# Altium schematic sheet HEADER_COLLECTION.SchDoc
size B
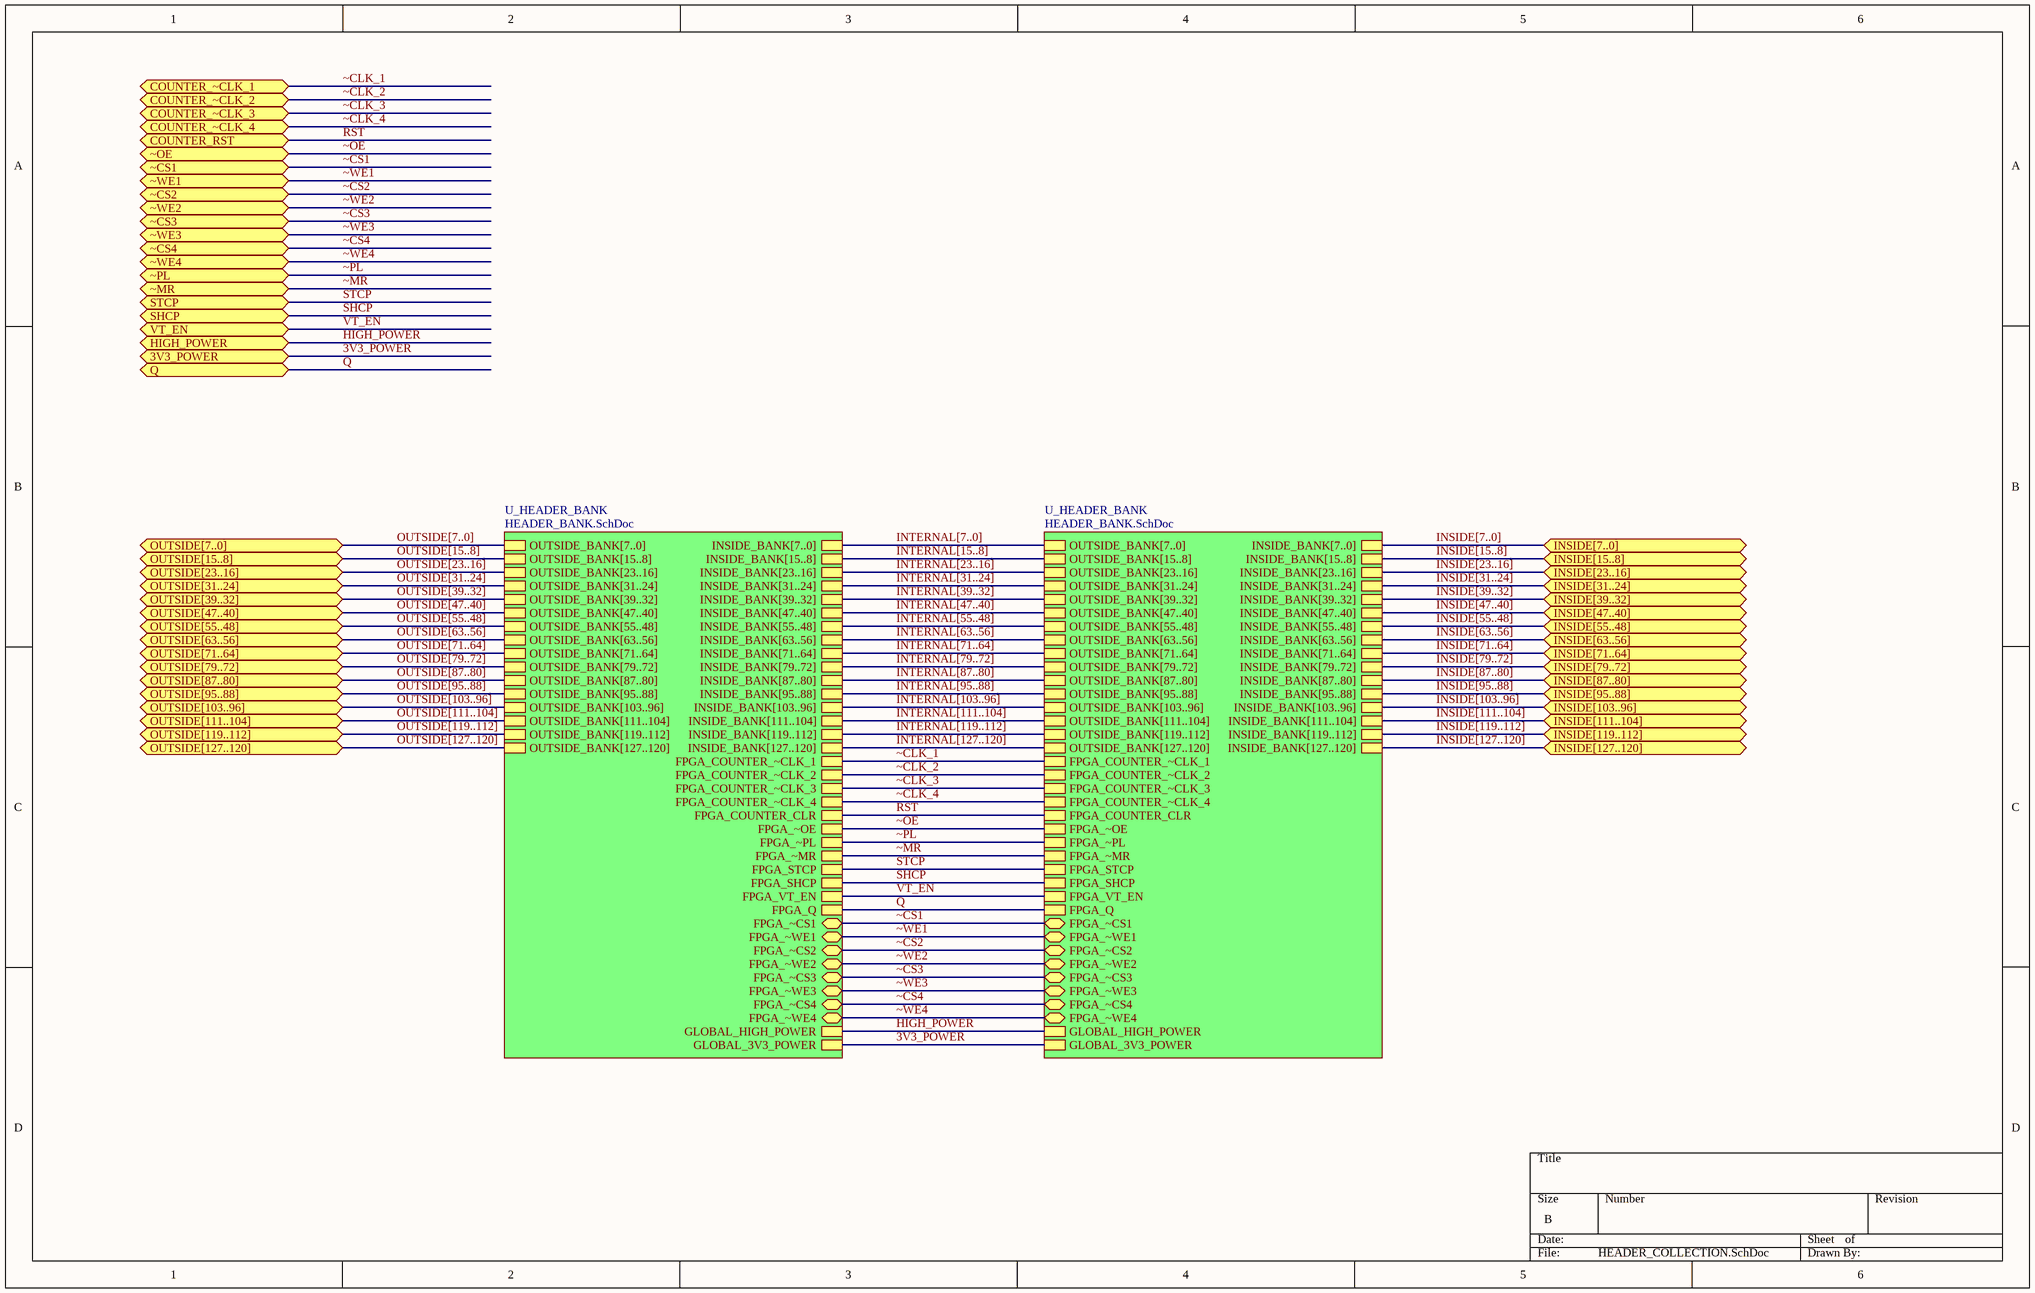
[diagram p0: HEADER_COLLECTION.SchDoc]

## Sub-sheets
U_HEADER_BANK = HEADER_BANK.SchDoc: OUTSIDE_BANK[7..0], OUTSIDE_BANK[15..8], OUTSIDE_BANK[23..16], OUTSIDE_BANK[31..24], OUTSIDE_BANK[39..32], OUTSIDE_BANK[47..40], OUTSIDE_BANK[55..48], OUTSIDE_BANK[63..56], OUTSIDE_BANK[71..64], OUTSIDE_BANK[79..72], OUTSIDE_BANK[87..80], OUTSIDE_BANK[95..88], OUTSIDE_BANK[103..96], OUTSIDE_BANK[111..104], OUTSIDE_BANK[119..112], OUTSIDE_BANK[127..120], INSIDE_BANK[7..0], INSIDE_BANK[15..8], INSIDE_BANK[23..16], INSIDE_BANK[31..24], INSIDE_BANK[39..32], INSIDE_BANK[47..40], INSIDE_BANK[55..48], INSIDE_BANK[63..56], INSIDE_BANK[71..64], INSIDE_BANK[79..72], INSIDE_BANK[87..80], INSIDE_BANK[95..88], INSIDE_BANK[103..96], INSIDE_BANK[111..104], INSIDE_BANK[119..112], INSIDE_BANK[127..120], FPGA_COUNTER_~CLK_1, FPGA_COUNTER_~CLK_2, FPGA_COUNTER_~CLK_3, FPGA_COUNTER_~CLK_4, FPGA_COUNTER_CLR, FPGA_~OE, FPGA_~PL, FPGA_~MR, FPGA_STCP, FPGA_SHCP, FPGA_VT_EN, GLOBAL_HIGH_POWER, GLOBAL_3V3_POWER, FPGA_Q, FPGA_~CS1, FPGA_~WE1, FPGA_~CS2, FPGA_~CS3, FPGA_~WE3, FPGA_~CS4, FPGA_~WE4, FPGA_~WE2
U_HEADER_BANK = HEADER_BANK.SchDoc: OUTSIDE_BANK[7..0], OUTSIDE_BANK[15..8], OUTSIDE_BANK[23..16], OUTSIDE_BANK[31..24], OUTSIDE_BANK[39..32], OUTSIDE_BANK[47..40], OUTSIDE_BANK[55..48], OUTSIDE_BANK[63..56], OUTSIDE_BANK[71..64], OUTSIDE_BANK[79..72], OUTSIDE_BANK[87..80], OUTSIDE_BANK[95..88], OUTSIDE_BANK[103..96], OUTSIDE_BANK[111..104], OUTSIDE_BANK[119..112], OUTSIDE_BANK[127..120], INSIDE_BANK[7..0], INSIDE_BANK[15..8], INSIDE_BANK[23..16], INSIDE_BANK[31..24], INSIDE_BANK[39..32], INSIDE_BANK[47..40], INSIDE_BANK[55..48], INSIDE_BANK[63..56], INSIDE_BANK[71..64], INSIDE_BANK[79..72], INSIDE_BANK[87..80], INSIDE_BANK[95..88], INSIDE_BANK[103..96], INSIDE_BANK[111..104], INSIDE_BANK[119..112], INSIDE_BANK[127..120], FPGA_COUNTER_~CLK_1, FPGA_COUNTER_~CLK_2, FPGA_COUNTER_~CLK_3, FPGA_COUNTER_~CLK_4, FPGA_COUNTER_CLR, FPGA_~OE, FPGA_~PL, FPGA_~MR, FPGA_STCP, FPGA_SHCP, GLOBAL_HIGH_POWER, GLOBAL_3V3_POWER, FPGA_Q, FPGA_VT_EN, FPGA_~CS1, FPGA_~WE1, FPGA_~CS2, FPGA_~CS3, FPGA_~WE3, FPGA_~CS4, FPGA_~WE4, FPGA_~WE2

## Ports
3V3_POWER, COUNTER_RST, COUNTER_~CLK_1, COUNTER_~CLK_2, COUNTER_~CLK_3, COUNTER_~CLK_4, HIGH_POWER, INSIDE[7..0], INSIDE[15..8], INSIDE[23..16], INSIDE[31..24], INSIDE[39..32], INSIDE[47..40], INSIDE[55..48], INSIDE[63..56], INSIDE[71..64], INSIDE[79..72], INSIDE[87..80], INSIDE[95..88], INSIDE[103..96], INSIDE[111..104], INSIDE[119..112], INSIDE[127..120], OUTSIDE[7..0], OUTSIDE[15..8], OUTSIDE[23..16], OUTSIDE[31..24], OUTSIDE[39..32], OUTSIDE[47..40], OUTSIDE[55..48], OUTSIDE[63..56], OUTSIDE[71..64], OUTSIDE[79..72], OUTSIDE[87..80], OUTSIDE[95..88], OUTSIDE[103..96], OUTSIDE[111..104], OUTSIDE[119..112], OUTSIDE[127..120], Q, SHCP, STCP, VT_EN, ~CS1, ~CS2, ~CS3, ~CS4, ~MR, ~OE, ~PL, ~WE1, ~WE2, ~WE3, ~WE4

## Nets
3V3_POWER: port 3V3_POWER, sheet U_HEADER_BANK/GLOBAL_3V3_POWER, sheet U_HEADER_BANK/GLOBAL_3V3_POWER
HIGH_POWER: port HIGH_POWER, sheet U_HEADER_BANK/GLOBAL_HIGH_POWER, sheet U_HEADER_BANK/GLOBAL_HIGH_POWER
Q: port Q, sheet U_HEADER_BANK/FPGA_Q, sheet U_HEADER_BANK/FPGA_Q
RST: port COUNTER_RST, sheet U_HEADER_BANK/FPGA_COUNTER_CLR, sheet U_HEADER_BANK/FPGA_COUNTER_CLR
SHCP: port SHCP, sheet U_HEADER_BANK/FPGA_SHCP, sheet U_HEADER_BANK/FPGA_SHCP
STCP: port STCP, sheet U_HEADER_BANK/FPGA_STCP, sheet U_HEADER_BANK/FPGA_STCP
VT_EN: port VT_EN, sheet U_HEADER_BANK/FPGA_VT_EN, sheet U_HEADER_BANK/FPGA_VT_EN
~CLK_1: port COUNTER_~CLK_1, sheet U_HEADER_BANK/FPGA_COUNTER_~CLK_1, sheet U_HEADER_BANK/FPGA_COUNTER_~CLK_1
~CLK_2: port COUNTER_~CLK_2, sheet U_HEADER_BANK/FPGA_COUNTER_~CLK_2, sheet U_HEADER_BANK/FPGA_COUNTER_~CLK_2
~CLK_3: port COUNTER_~CLK_3, sheet U_HEADER_BANK/FPGA_COUNTER_~CLK_3, sheet U_HEADER_BANK/FPGA_COUNTER_~CLK_3
~CLK_4: port COUNTER_~CLK_4, sheet U_HEADER_BANK/FPGA_COUNTER_~CLK_4, sheet U_HEADER_BANK/FPGA_COUNTER_~CLK_4
~CS1: port ~CS1, sheet U_HEADER_BANK/FPGA_~CS1, sheet U_HEADER_BANK/FPGA_~CS1
~CS2: port ~CS2, sheet U_HEADER_BANK/FPGA_~CS2, sheet U_HEADER_BANK/FPGA_~CS2
~CS3: port ~CS3, sheet U_HEADER_BANK/FPGA_~CS3, sheet U_HEADER_BANK/FPGA_~CS3
~CS4: port ~CS4, sheet U_HEADER_BANK/FPGA_~CS4, sheet U_HEADER_BANK/FPGA_~CS4
~MR: port ~MR, sheet U_HEADER_BANK/FPGA_~MR, sheet U_HEADER_BANK/FPGA_~MR
~OE: port ~OE, sheet U_HEADER_BANK/FPGA_~OE, sheet U_HEADER_BANK/FPGA_~OE
~PL: port ~PL, sheet U_HEADER_BANK/FPGA_~PL, sheet U_HEADER_BANK/FPGA_~PL
~WE1: port ~WE1, sheet U_HEADER_BANK/FPGA_~WE1, sheet U_HEADER_BANK/FPGA_~WE1
~WE2: port ~WE2, sheet U_HEADER_BANK/FPGA_~WE2, sheet U_HEADER_BANK/FPGA_~WE2
~WE3: port ~WE3, sheet U_HEADER_BANK/FPGA_~WE3, sheet U_HEADER_BANK/FPGA_~WE3
~WE4: port ~WE4, sheet U_HEADER_BANK/FPGA_~WE4, sheet U_HEADER_BANK/FPGA_~WE4

## Buses and harness runs
bus INSIDE[7..0] = port INSIDE[7..0] = sheet U_HEADER_BANK/INSIDE_BANK[7..0]
bus INSIDE[15..8] = port INSIDE[15..8] = sheet U_HEADER_BANK/INSIDE_BANK[15..8]
bus INSIDE[23..16] = port INSIDE[23..16] = sheet U_HEADER_BANK/INSIDE_BANK[23..16]
bus INSIDE[31..24] = port INSIDE[31..24] = sheet U_HEADER_BANK/INSIDE_BANK[31..24]
bus INSIDE[39..32] = port INSIDE[39..32] = sheet U_HEADER_BANK/INSIDE_BANK[39..32]
bus INSIDE[47..40] = port INSIDE[47..40] = sheet U_HEADER_BANK/INSIDE_BANK[47..40]
bus INSIDE[55..48] = port INSIDE[55..48] = sheet U_HEADER_BANK/INSIDE_BANK[55..48]
bus INSIDE[63..56] = port INSIDE[63..56] = sheet U_HEADER_BANK/INSIDE_BANK[63..56]
bus INSIDE[71..64] = port INSIDE[71..64] = sheet U_HEADER_BANK/INSIDE_BANK[71..64]
bus INSIDE[79..72] = port INSIDE[79..72] = sheet U_HEADER_BANK/INSIDE_BANK[79..72]
bus INSIDE[87..80] = port INSIDE[87..80] = sheet U_HEADER_BANK/INSIDE_BANK[87..80]
bus INSIDE[95..88] = port INSIDE[95..88] = sheet U_HEADER_BANK/INSIDE_BANK[95..88]
bus INSIDE[103..96] = port INSIDE[103..96] = sheet U_HEADER_BANK/INSIDE_BANK[103..96]
bus INSIDE[111..104] = port INSIDE[111..104] = sheet U_HEADER_BANK/INSIDE_BANK[111..104]
bus INSIDE[119..112] = port INSIDE[119..112] = sheet U_HEADER_BANK/INSIDE_BANK[119..112]
bus INSIDE[127..120] = port INSIDE[127..120] = sheet U_HEADER_BANK/INSIDE_BANK[127..120]
bus INTERNAL[7..0] = sheet U_HEADER_BANK/INSIDE_BANK[7..0] = sheet U_HEADER_BANK/OUTSIDE_BANK[7..0]
bus INTERNAL[15..8] = sheet U_HEADER_BANK/INSIDE_BANK[15..8] = sheet U_HEADER_BANK/OUTSIDE_BANK[15..8]
bus INTERNAL[23..16] = sheet U_HEADER_BANK/INSIDE_BANK[23..16] = sheet U_HEADER_BANK/OUTSIDE_BANK[23..16]
bus INTERNAL[31..24] = sheet U_HEADER_BANK/INSIDE_BANK[31..24] = sheet U_HEADER_BANK/OUTSIDE_BANK[31..24]
bus INTERNAL[39..32] = sheet U_HEADER_BANK/INSIDE_BANK[39..32] = sheet U_HEADER_BANK/OUTSIDE_BANK[39..32]
bus INTERNAL[47..40] = sheet U_HEADER_BANK/INSIDE_BANK[47..40] = sheet U_HEADER_BANK/OUTSIDE_BANK[47..40]
bus INTERNAL[55..48] = sheet U_HEADER_BANK/INSIDE_BANK[55..48] = sheet U_HEADER_BANK/OUTSIDE_BANK[55..48]
bus INTERNAL[63..56] = sheet U_HEADER_BANK/INSIDE_BANK[63..56] = sheet U_HEADER_BANK/OUTSIDE_BANK[63..56]
bus INTERNAL[71..64] = sheet U_HEADER_BANK/INSIDE_BANK[71..64] = sheet U_HEADER_BANK/OUTSIDE_BANK[71..64]
bus INTERNAL[79..72] = sheet U_HEADER_BANK/INSIDE_BANK[79..72] = sheet U_HEADER_BANK/OUTSIDE_BANK[79..72]
bus INTERNAL[87..80] = sheet U_HEADER_BANK/INSIDE_BANK[87..80] = sheet U_HEADER_BANK/OUTSIDE_BANK[87..80]
bus INTERNAL[95..88] = sheet U_HEADER_BANK/INSIDE_BANK[95..88] = sheet U_HEADER_BANK/OUTSIDE_BANK[95..88]
bus INTERNAL[103..96] = sheet U_HEADER_BANK/INSIDE_BANK[103..96] = sheet U_HEADER_BANK/OUTSIDE_BANK[103..96]
bus INTERNAL[111..104] = sheet U_HEADER_BANK/INSIDE_BANK[111..104] = sheet U_HEADER_BANK/OUTSIDE_BANK[111..104]
bus INTERNAL[119..112] = sheet U_HEADER_BANK/INSIDE_BANK[119..112] = sheet U_HEADER_BANK/OUTSIDE_BANK[119..112]
bus INTERNAL[127..120] = sheet U_HEADER_BANK/INSIDE_BANK[127..120] = sheet U_HEADER_BANK/OUTSIDE_BANK[127..120]
bus OUTSIDE[7..0] = port OUTSIDE[7..0] = sheet U_HEADER_BANK/OUTSIDE_BANK[7..0]
bus OUTSIDE[15..8] = port OUTSIDE[15..8] = sheet U_HEADER_BANK/OUTSIDE_BANK[15..8]
bus OUTSIDE[23..16] = port OUTSIDE[23..16] = sheet U_HEADER_BANK/OUTSIDE_BANK[23..16]
bus OUTSIDE[31..24] = port OUTSIDE[31..24] = sheet U_HEADER_BANK/OUTSIDE_BANK[31..24]
bus OUTSIDE[39..32] = port OUTSIDE[39..32] = sheet U_HEADER_BANK/OUTSIDE_BANK[39..32]
bus OUTSIDE[47..40] = port OUTSIDE[47..40] = sheet U_HEADER_BANK/OUTSIDE_BANK[47..40]
bus OUTSIDE[55..48] = port OUTSIDE[55..48] = sheet U_HEADER_BANK/OUTSIDE_BANK[55..48]
bus OUTSIDE[63..56] = port OUTSIDE[63..56] = sheet U_HEADER_BANK/OUTSIDE_BANK[63..56]
bus OUTSIDE[71..64] = port OUTSIDE[71..64] = sheet U_HEADER_BANK/OUTSIDE_BANK[71..64]
bus OUTSIDE[79..72] = port OUTSIDE[79..72] = sheet U_HEADER_BANK/OUTSIDE_BANK[79..72]
bus OUTSIDE[87..80] = port OUTSIDE[87..80] = sheet U_HEADER_BANK/OUTSIDE_BANK[87..80]
bus OUTSIDE[95..88] = port OUTSIDE[95..88] = sheet U_HEADER_BANK/OUTSIDE_BANK[95..88]
bus OUTSIDE[103..96] = port OUTSIDE[103..96] = sheet U_HEADER_BANK/OUTSIDE_BANK[103..96]
bus OUTSIDE[111..104] = port OUTSIDE[111..104] = sheet U_HEADER_BANK/OUTSIDE_BANK[111..104]
bus OUTSIDE[119..112] = port OUTSIDE[119..112] = sheet U_HEADER_BANK/OUTSIDE_BANK[119..112]
bus OUTSIDE[127..120] = port OUTSIDE[127..120] = sheet U_HEADER_BANK/OUTSIDE_BANK[127..120]